# Altium schematic sheet power_supplies.SchDoc
size A4
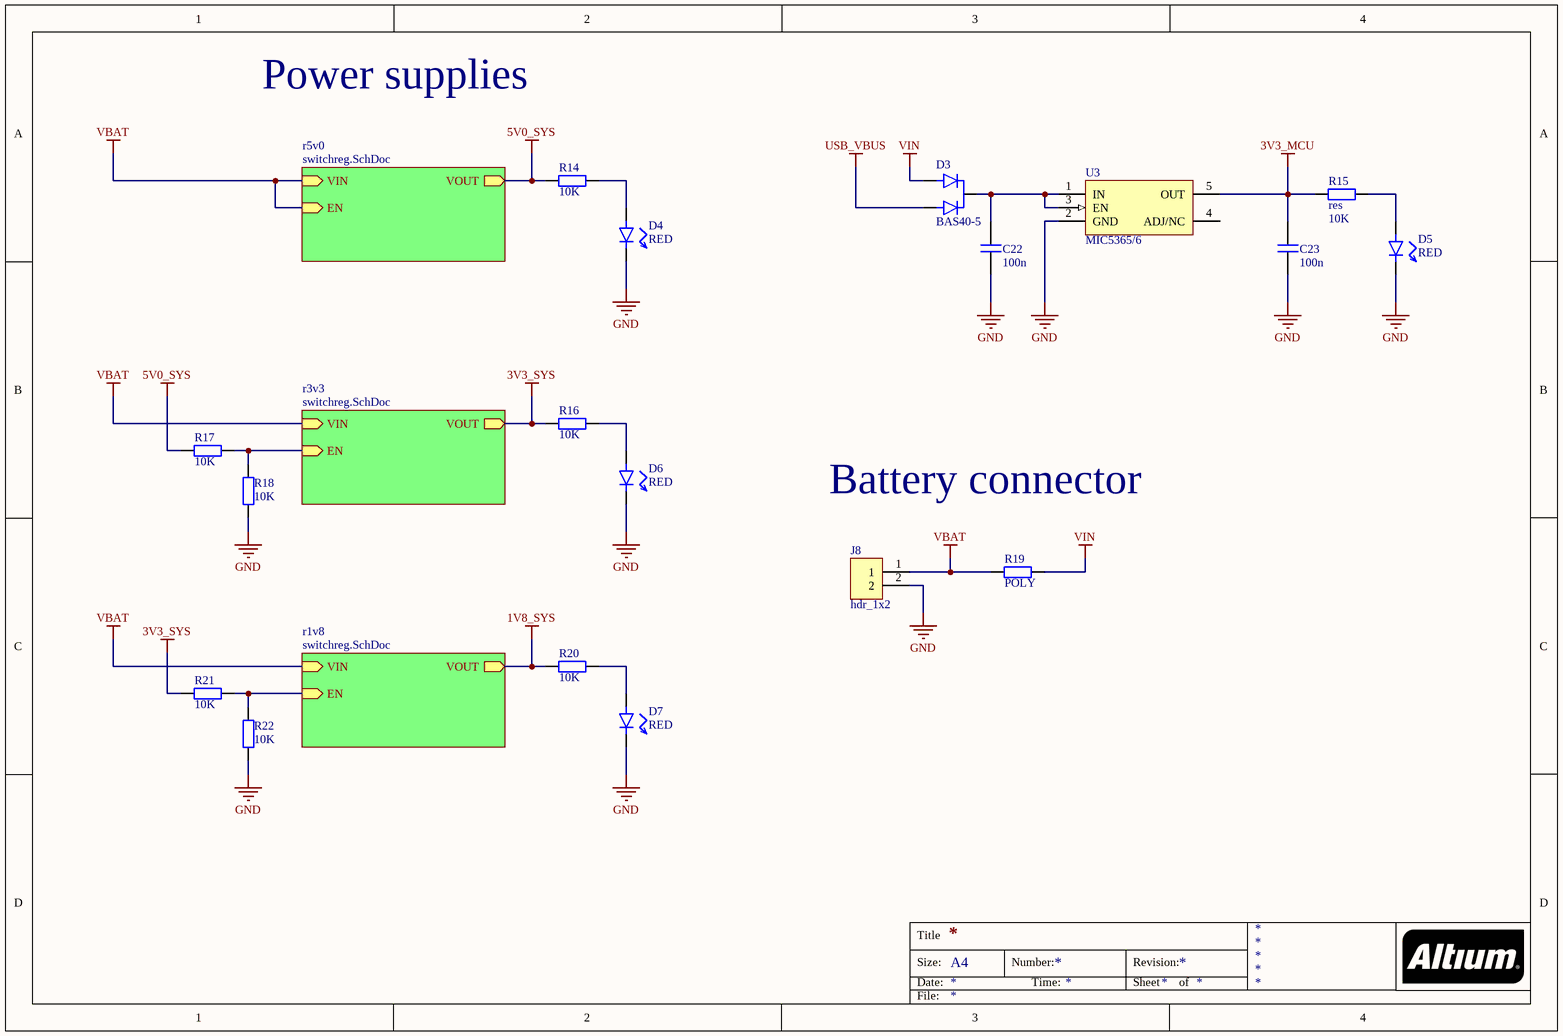
[diagram p0: power_supplies.SchDoc]

## Parts
C22  value 100n  [CAPC1005X06N]  (hidden comment: cap)
C23  value 100n  [CAPC1005X06N]  (hidden comment: cap)
D3  BAS40-5  [SOT23_CC]
D4  value RED  [CAPCP1005X06N]  (hidden comment: led)
D5  value RED  [CAPCP1005X06N]  (hidden comment: led)
D6  value RED  [CAPCP1005X06N]  (hidden comment: led)
D7  value RED  [CAPCP1005X06N]  (hidden comment: led)
J8  hdr_1x2  [hdr_1x2_200mil]
R14  value 10K  [RESC1005X04N]  (hidden comment: res)
R15  res  value 10K  [RESC1005X04N]
R16  value 10K  [RESC1005X04N]  (hidden comment: res)
R17  value 10K  [RESC1005X04N]  (hidden comment: res)
R18  value 10K  [RESC1005X04N]  (hidden comment: res)
R19  value POLY  [RESC2012X06N]  (hidden comment: res)
R20  value 10K  [RESC1005X04N]  (hidden comment: res)
R21  value 10K  [RESC1005X04N]  (hidden comment: res)
R22  value 10K  [RESC1005X04N]  (hidden comment: res)
U3  MIC5365/6  [SOT65P210X110-5N]

## Sub-sheets
r1v8 = switchreg.SchDoc: VIN (in), VOUT (out), EN (in)
r3v3 = switchreg.SchDoc: VIN (in), VOUT (out), EN (in)
r5v0 = switchreg.SchDoc: VIN (in), VOUT (out), EN (in)

## Nets
1V8_SYS: R20.1 ; sheet r1v8/VOUT
3V3_MCU: C23.2 R15.1 U3.5(OUT)
3V3_SYS: R16.1 R21.1 ; sheet r3v3/VOUT
5V0_SYS: R14.1 R17.1 ; sheet r5v0/VOUT
GND: C22.1 C23.1 D4.C D5.C D6.C D7.C J8.2 R18.1 R22.1 U3.2(GND)
USB_VBUS: D3.A2
VBAT: J8.1 R19.1 ; sheet r5v0/VIN, sheet r5v0/EN, sheet r3v3/VIN, sheet r1v8/VIN
VIN: D3.A1 R19.2
NetC22_2: C22.2 D3.C U3.1(IN) U3.3(EN)
NetD4_A: D4.A R14.2
NetD5_A: D5.A R15.2
NetD6_A: D6.A R16.2
NetD7_A: D7.A R20.2
NetR17_2: R17.2 R18.2 ; sheet r3v3/EN
NetR21_2: R21.2 R22.2 ; sheet r1v8/EN

Not connected (* = marked no-connect by the designer): U3 4(ADJ/NC)

## Notes on the sheet
- Power supplies
- Battery connector
- Title
- Size:
- Date:
- A4
- Number:
- Time:
- Revision:
- Sheet
- of
- File:

## Library data of the parts
C22 C23 = cap: Capacitor
D3 = diode_dual_cc: Diode Common Cathode
D4-D7 = led: pin to pad: A>1 C>2
J8 = hdr_1x2: 1x2 Header
R14-R22 = res: Resistor
U3 = mic5365: 5pin voltage regulator